# Altium schematic sheet RTU_LMG_Linear_Voltage_Regulator_3V8.SchDoc
size A; Organization: Altium Limited; Address1: L3, 12a Rodborough Rd; Address2: Frenchs Forest; Address3: NSW; Address4: Australia 2086; SheetNumber: 4; SheetTotal: 17
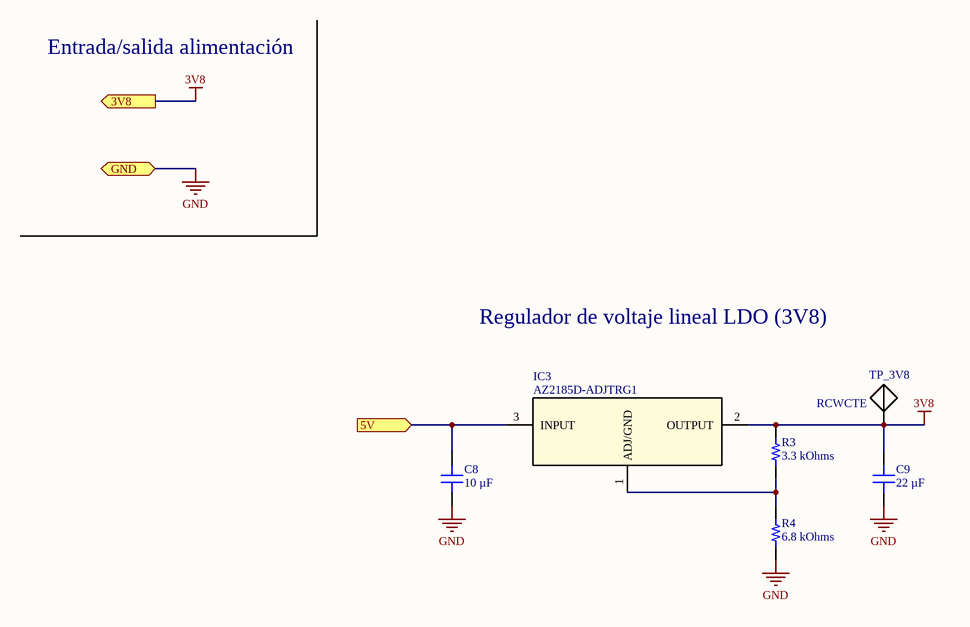
[diagram p0: RTU_LMG_Linear_Voltage_Regulator_3V8.SchDoc]

## Parts
C8  10 µF  [CAP 1210_3225 - 1MM]
C9  22 µF  [CAP 0805_2012]
IC3  AZ2185D-ADJTRG1  [TO252-3]
R3  3.3 kOhms  [RES 0603_1608]
R4  6.8 kOhms  [RES 0603_1608]
TP_3V8  RCWCTE  [RCWCTE]

## Ports
3V8 (out), 5V (in), GND (bidir)

## Nets
3V8: C9.2 IC3.2(OUTPUT) R3.2 TP_3V8.1(TP) ; port 3V8
GND: C8.2 C9.1 R4.1 ; port GND
5V: C8.1 IC3.3(INPUT) ; port 5V
NetIC3_1: IC3.1(ADJ/GND) R3.1 R4.2

## Notes on the sheet
- Entrada/salida alimentación
- Regulador de voltaje lineal LDO (3V8)
- Title
- Size:
- Date:
- A
- Number:
- Time:
- Revision:
- Sheet
- of

## Library data of the parts
C8 = C3225X7R1N106K250AC: CAP CER 10UF 75V X7R 1210; manufacturer: TDK Corporation; Tolerance: ±10%; Part Number: C3225X7R1N106K250AC; Value: 10 µF; Applications: General Purpose; Capacitance: 10 µF; componentlink1description: Datasheet; componentlink1url: https://product.tdk.com/info/en/catalog/datasheets/mlcc_commercial_general_en.pdf?ref_disty=digikey; componentlink2description: DigiKey Link; componentlink2url: https://www.digikey.com/en/products/detail/tdk-corporation/C3225X7R1N106K250AC/10413502; Device Package: 1210 (3225 Metric); Features: Low ESL; lastupdated: 10/29/2023 7:38:56 PM; Lifecycle Status: Active; Minimum Order: 1; Mounting Type: Surface Mount, MLCC; Operating Temperature: -55°C ~ 125°C; Package / Case: 1210 (3225 Metric); packaging: TapeAndReel; partid: 45109; Part Status: Active; price: 0.29; series: C; Size / Dimension: 0.126" L x 0.098" W (3.20mm x 2.50mm); Supplier 1: DigiKey; Supplier Part Number 1: 445-C3225X7R1N106K250ACCT-ND; Temperature Coefficient: X7R; Thickness (Max): 0.110" (2.80mm); Voltage - Rated: 75V
C9 = CL21A226MOCLRNC: CAP CER 22UF 16V X5R 0805; manufacturer: Samsung Electro-Mechanics; Tolerance: ±20%; Part Number: CL21A226MOCLRNC; Value: 22 µF; Applications: General Purpose; Capacitance: 22 µF; componentlink1description: Datasheet; componentlink1url: http://www.samsungsem.com/kr/support/product-search/mlcc/CL21A226MOCLRNC.jsp; componentlink2description: DigiKey Link; componentlink2url: https://www.digikey.com/en/products/detail/samsung-electro-mechanics/CL21A226MOCLRNC/5961264; Device Package: 0805 (2012 Metric); Features: Low Profile; lastupdated: 10/30/2023 7:14:19 PM; Lifecycle Status: Active; Minimum Order: 1; Mounting Type: Surface Mount, MLCC; Operating Temperature: -55°C ~ 85°C; Package / Case: 0805 (2012 Metric); packaging: TapeAndReel; partid: 4767; Part Status: Active; price: 0.05; series: CL; Size / Dimension: 0.079" L x 0.049" W (2.00mm x 1.25mm); Supplier 1: DigiKey; Supplier Part Number 1: 1276-6780-1-ND; Temperature Coefficient: X5R; Thickness (Max): 0.037" (0.95mm); Voltage - Rated: 16V
IC3 = AZ2185D-ADJTRG1: Fuente regulada LDO - 3V8 - 3A; Manufacturer_Name: Diodes Inc.; Datasheet Link: https://www.diodes.com/assets/Datasheets/AZ2185.pdf; Height: 2.39mm; Manufacturer_Part_Number: AZ2185D-ADJTRG1; Mouser Part Number: 621-AZ2185D-ADJTRG1; Mouser Price/Stock: https://www.mouser.co.uk/ProductDetail/Diodes-Incorporated/AZ2185D-ADJTRG1?qs=YCa%2FAAYMW022EhXzrDAtDg%3D%3D; Arrow Part Number: AZ2185D-ADJTRG1; Arrow Price/Stock: https://www.arrow.com/en/products/az2185d-adjtrg1/diodes-incorporated
R3 = CRGH0603F3K3: CRGH0603 1% 3K3 0.2W; Manufacturer: TE Connectivity Passive Product; Power (Watts): 0.2W, 1/5W; Temperature Coefficient: ±100ppm/°C; Part Number: CRGH0603F3K3; Value: 3.3 kOhms; ComponentLink1Description: Datasheet; ComponentLink1URL: https://www.te.com/commerce/DocumentDelivery/DDEController?Action=srchrtrv&DocNm=1773204-1&DocType=DS&DocLang=English; ComponentLink2Description: DigiKey Link; ComponentLink2URL: https://www.digikey.com/en/products/detail/te-connectivity-passive-product/CRGH0603F3K3/7495057; Composition: Thick Film; Device Package: 0603 (1608 Metric); Height - Seated (Max): 0.022" (0.55mm); LastUpdated: 10/31/2023 7:35:24 PM; Lifecycle Status: Active; Minimum Order: 1; Number of Terminations: 2; Operating Temperature: -55°C ~ 155°C; Package / Case: 0603 (1608 Metric); Packaging: TapeAndReel; PartId: 5686; Part Status: Active; Price: 0.01; Resistance: 3.3 kOhms; Series: CRGH, Neohm; Size / Dimension: 0.063" L x 0.031" W (1.60mm x 0.80mm); Supplier 1: DigiKey; Supplier Part Number 1: A129543CT-ND; Supplier Device Package: 0603; Tolerance: ±1%
R4 = CRGP0603F6K8: RES 6.8K OHM 1% 1/4W 0603; Manufacturer: TE Connectivity Passive Product; Power (Watts): 0.25W, 1/4W; Temperature Coefficient: ±100ppm/°C; Part Number: CRGP0603F6K8; Value: 6.8 kOhms; ComponentLink1Description: Datasheet; ComponentLink1URL: https://www.te.com/commerce/DocumentDelivery/DDEController?Action=srchrtrv&DocNm=9-1773463-9&DocType=DS&DocLang=English; ComponentLink2Description: DigiKey Link; ComponentLink2URL: https://www.digikey.com/en/products/detail/te-connectivity-passive-product/CRGP0603F6K8/8577028; Composition: Thick Film; Device Package: 0603 (1608 Metric); Features: Pulse Withstanding; Height - Seated (Max): 0.022" (0.55mm); LastUpdated: 10/31/2023 7:34:31 PM; Lifecycle Status: Active; Minimum Order: 1; Number of Terminations: 2; Operating Temperature: -55°C ~ 155°C; Package / Case: 0603 (1608 Metric); Packaging: TapeAndReel; PartId: 20908; Part Status: Active; Price: 0.01; Resistance: 6.8 kOhms; Series: CRGP; Size / Dimension: 0.063" L x 0.031" W (1.60mm x 0.80mm); Supplier 1: DigiKey; Supplier Part Number 1: A130426CT-ND; Supplier Device Package: 0603; Tolerance: ±1%
TP_3V8 = RCWCTE: - PC Test Point - - Plating Surface Mount Mounting Type; MF: KOA Speer; Check_prices: https://www.snapeda.com/parts/RCWCTE/KOA+Speer/view-part/?ref=eda; SnapEDA_Link: https://www.snapeda.com/parts/RCWCTE/KOA+Speer/view-part/?ref=snap; Digi-Key_Part_Number: 2019-RCWCTETR-ND; Value: *; Purchase-URL: https://pricing.snapeda.com/search/part/RCWCTE/?ref=eda; Package: None; MP: RCWCTE